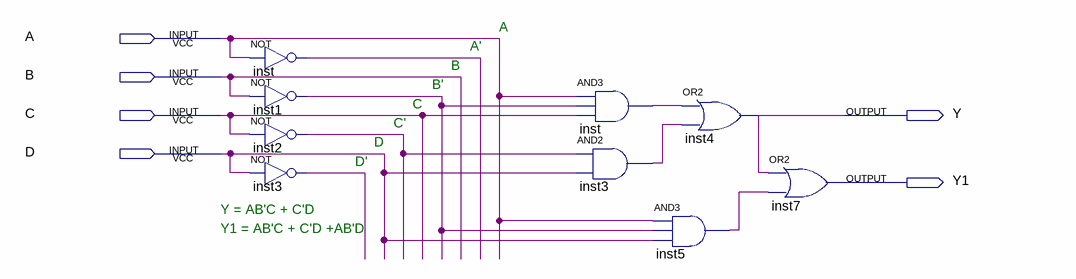
[diagram p0: schematic sheet]
// Quartus schematic lab2_g8_p1.bdf as structural Verilog: 9 symbols, 6 pins
module lab2_g8_p1 (
  input  A,
  input  B,
  input  C,
  input  D,
  output Y,
  output Y1
);

  wire inst1_out, inst2_out, inst3_out, inst3_out_2, inst5_out, inst_out, inst_out_2;

  not inst (inst_out, A);
  not inst1 (inst1_out, B);
  not inst2 (inst2_out, C);
  not inst3 (inst3_out, D);
  and inst_dup2 (inst_out_2, A, inst1_out, C);
  and inst3_dup2 (inst3_out_2, inst2_out, D);
  or inst4 (Y, inst_out_2, inst3_out_2);
  and inst5 (inst5_out, A, inst1_out, D);
  or inst7 (Y1, Y, inst5_out);

  // Notes on the sheet:
  //   A
  //   A'
  //   B
  //   B'
  //   C
  //   C'
  //   D
  //   D'
  //   Y = AB'C + C'D
  //   Y1 = AB'C + C'D +AB'D
endmodule
